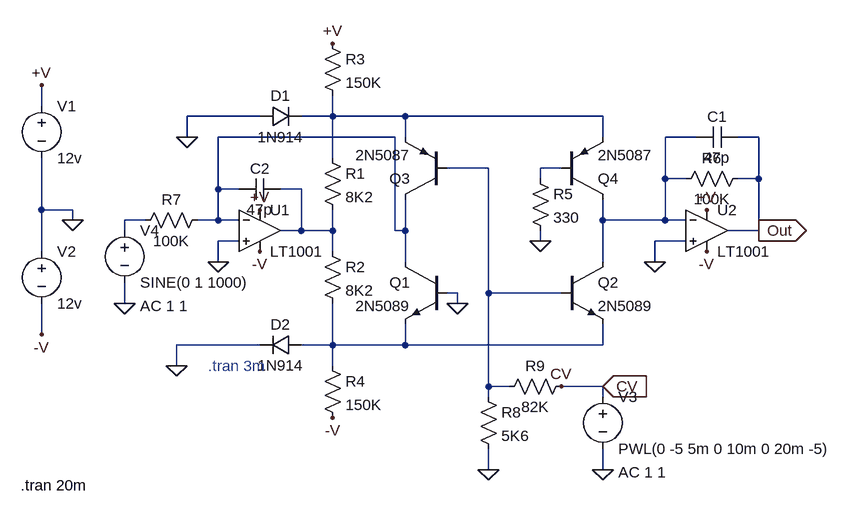
[diagram p0: schematic Serge%20VCA.asc]
Serge%20VCA.asc, the LTspice schematic file:
Version 4
SHEET 1 892 680
WIRE -368 16 -368 -16
WIRE -32 32 -144 32
WIRE 80 32 80 0
WIRE 80 32 32 32
WIRE 192 32 80 32
WIRE 496 32 192 32
WIRE -144 64 -144 32
WIRE 176 64 -96 64
WIRE 192 64 192 32
WIRE 496 64 496 32
WIRE 640 64 592 64
WIRE 736 64 704 64
WIRE 80 96 80 32
WIRE 320 112 256 112
WIRE 432 112 400 112
WIRE 400 128 400 112
WIRE 592 128 592 64
WIRE 624 128 592 128
WIRE 736 128 736 64
WIRE 736 128 704 128
WIRE -96 144 -96 64
WIRE -64 144 -96 144
WIRE 32 144 0 144
WIRE -368 176 -368 96
WIRE -320 176 -368 176
WIRE -320 192 -320 176
WIRE -208 192 -240 192
WIRE -96 192 -96 144
WIRE -96 192 -128 192
WIRE -64 192 -96 192
WIRE 496 192 496 160
WIRE 592 192 592 128
WIRE 592 192 496 192
WIRE 624 192 592 192
WIRE -240 208 -240 192
WIRE 32 208 32 144
WIRE 32 208 0 208
WIRE 80 208 80 176
WIRE 80 208 32 208
WIRE 176 208 176 64
WIRE 192 208 192 160
WIRE 192 208 176 208
WIRE 736 208 736 128
WIRE 736 208 688 208
WIRE -64 224 -96 224
WIRE 400 224 400 208
WIRE 624 224 576 224
WIRE -368 240 -368 176
WIRE 80 240 80 208
WIRE -96 256 -96 224
WIRE 192 256 192 208
WIRE 496 256 496 192
WIRE 576 256 576 224
WIRE 272 304 256 304
WIRE 320 304 320 112
WIRE 432 304 320 304
WIRE -240 320 -240 288
WIRE 272 320 272 304
WIRE -368 368 -368 320
WIRE -32 384 -160 384
WIRE 80 384 80 320
WIRE 80 384 32 384
WIRE 192 384 192 352
WIRE 192 384 80 384
WIRE 496 384 496 352
WIRE 496 384 192 384
WIRE -160 416 -160 384
WIRE 80 416 80 384
WIRE 320 448 320 304
WIRE 352 448 320 448
WIRE 496 448 432 448
WIRE 320 464 320 448
WIRE 496 464 496 448
WIRE 320 576 320 544
WIRE 496 576 496 544
FLAG -96 256 0
FLAG 272 320 0
FLAG 576 256 0
FLAG 400 224 0
FLAG 320 576 0
FLAG 432 448 CV
FLAG -368 -16 +V
FLAG -32 176 +V
FLAG 656 176 +V
FLAG 80 -80 +V
FLAG -368 368 -V
FLAG -32 240 -V
FLAG 80 496 -V
FLAG 656 240 -V
FLAG 496 576 0
FLAG -320 192 0
FLAG -240 320 0
FLAG -144 64 0
FLAG -160 416 0
FLAG 736 208 Out
IOPIN 736 208 Out
FLAG 496 448 CV
IOPIN 496 448 In
SYMBOL Opamps\\LT1001 -32 144 R0
SYMATTR InstName U1
SYMBOL Opamps\\LT1001 656 144 R0
SYMATTR InstName U2
SYMBOL npn 256 256 M0
SYMATTR InstName Q1
SYMATTR Value 2N5089
SYMBOL npn 432 256 R0
SYMATTR InstName Q2
SYMATTR Value 2N5089
SYMBOL res 64 80 R0
SYMATTR InstName R1
SYMATTR Value 8K2
SYMBOL res 64 224 R0
SYMATTR InstName R2
SYMATTR Value 8K2
SYMBOL res 64 -96 R0
SYMATTR InstName R3
SYMATTR Value 150K
SYMBOL res 64 400 R0
SYMATTR InstName R4
SYMATTR Value 150K
SYMBOL pnp 256 160 R180
SYMATTR InstName Q3
SYMATTR Value 2N5087
SYMBOL pnp 432 160 M180
SYMATTR InstName Q4
SYMATTR Value 2N5087
SYMBOL res 384 112 R0
SYMATTR InstName R5
SYMATTR Value 330
SYMBOL res 720 112 R90
WINDOW 0 0 56 VBottom 0
WINDOW 3 32 56 VTop 0
SYMATTR InstName R6
SYMATTR Value 100K
SYMBOL cap 704 48 R90
WINDOW 0 0 32 VBottom 0
WINDOW 3 32 32 VTop 0
SYMATTR InstName C1
SYMATTR Value 47p
SYMBOL cap 0 128 R90
WINDOW 0 0 32 VBottom 0
WINDOW 3 32 32 VTop 0
SYMATTR InstName C2
SYMATTR Value 47p
SYMBOL res -112 176 R90
WINDOW 0 0 56 VBottom 0
WINDOW 3 32 56 VTop 0
SYMATTR InstName R7
SYMATTR Value 100K
SYMBOL res 304 448 R0
SYMATTR InstName R8
SYMATTR Value 5K6
SYMBOL res 448 432 R90
WINDOW 0 0 56 VBottom 0
WINDOW 3 32 56 VTop 0
SYMATTR InstName R9
SYMATTR Value 82K
SYMBOL voltage -368 0 R0
WINDOW 123 0 0 Left 0
WINDOW 39 0 0 Left 0
SYMATTR InstName V1
SYMATTR Value 12v
SYMBOL voltage -368 224 R0
WINDOW 123 0 0 Left 0
WINDOW 39 0 0 Left 0
SYMATTR InstName V2
SYMATTR Value 12v
SYMBOL voltage 496 448 R0
WINDOW 123 24 132 Left 0
WINDOW 39 0 0 Left 0
SYMATTR Value2 AC 1 1
SYMATTR InstName V3
SYMATTR Value PWL(0 -5 5m 0 10m 0 20m -5)
SYMBOL voltage -240 192 R0
WINDOW 123 24 132 Left 0
WINDOW 39 0 0 Left 0
SYMATTR Value2 AC 1 1
SYMATTR InstName V4
SYMATTR Value SINE(0 1 1000)
SYMBOL diode -32 48 R270
WINDOW 0 32 32 VTop 0
WINDOW 3 0 32 VBottom 0
SYMATTR InstName D1
SYMATTR Value 1N914
SYMBOL diode 32 368 R90
WINDOW 0 0 32 VBottom 0
WINDOW 3 32 32 VTop 0
SYMATTR InstName D2
SYMATTR Value 1N914
TEXT -112 416 Left 0 ;.tran 3m
TEXT -400 600 Left 0 !.tran 20m

The netlist it stands for:
* Serge%20VCA.asc
XU1 0 N002 +V -V N006 LT1001  ; pins In+ In- V+ V- OUT
XU2 0 N003 +V -V Out LT1001  ; pins In+ In- V+ V- OUT
Q1 N002 0 N008 0 2N5089
Q2 N003 N004 N008 0 2N5089
R1 N001 N006 8K2
R2 N006 N008 8K2
R3 +V N001 150K
R4 N008 -V 150K
Q3 N002 N004 N001 0 2N5087
Q4 N003 N005 N001 0 2N5087
R5 N005 0 330
R6 Out N003 100K
C1 Out N003 47p
C2 N006 N002 47p
R7 N002 N007 100K
R8 N004 0 5K6
R9 CV N004 82K
V1 +V 0 12v
V2 0 -V 12v
V3 CV 0 PWL(0 -5 5m 0 10m 0 20m -5) AC 1 1
V4 N007 0 SINE(0 1 1000) AC 1 1
D1 0 N001 1N914
D2 N008 0 1N914
.model D D
.lib standard.dio
.model NPN NPN
.model PNP PNP
.lib standard.bjt
* .tran 3m
.tran 20m
.lib LTC.lib
.backanno
.end